# EAGLE design silelis_version1 (EAGLE 7.6.0)
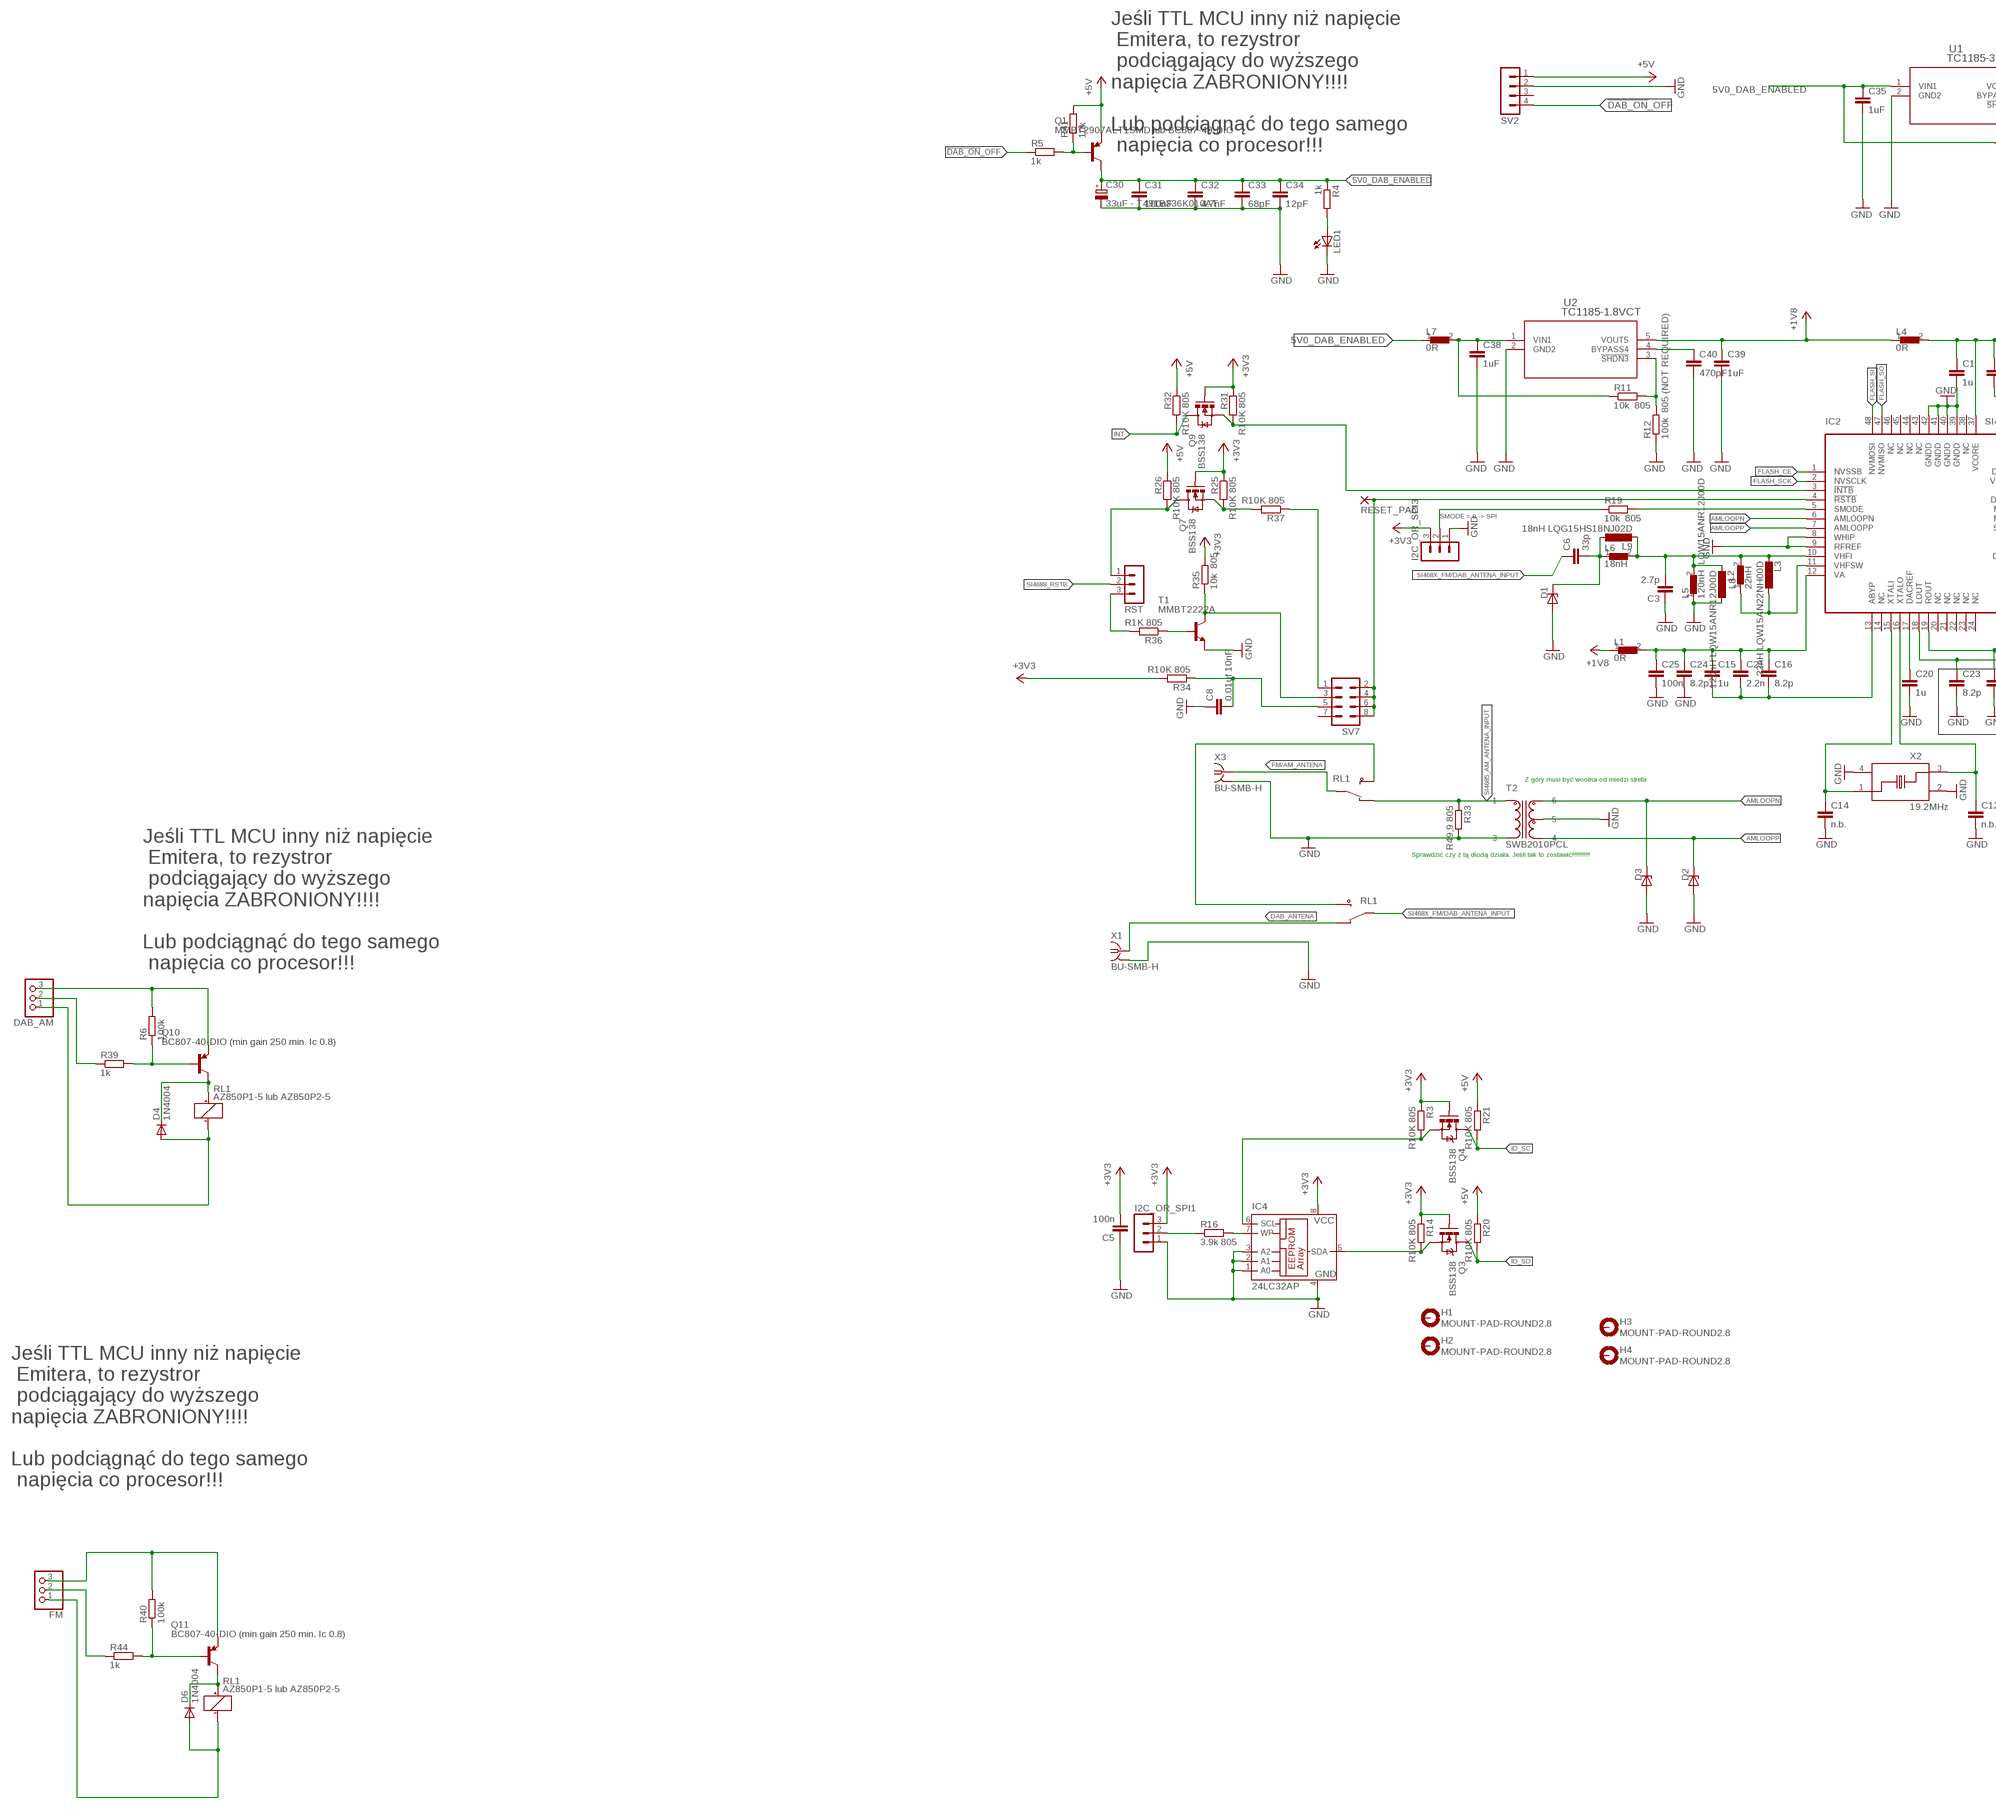
[diagram p0: schematic, sheet 1, part 1 of 2]
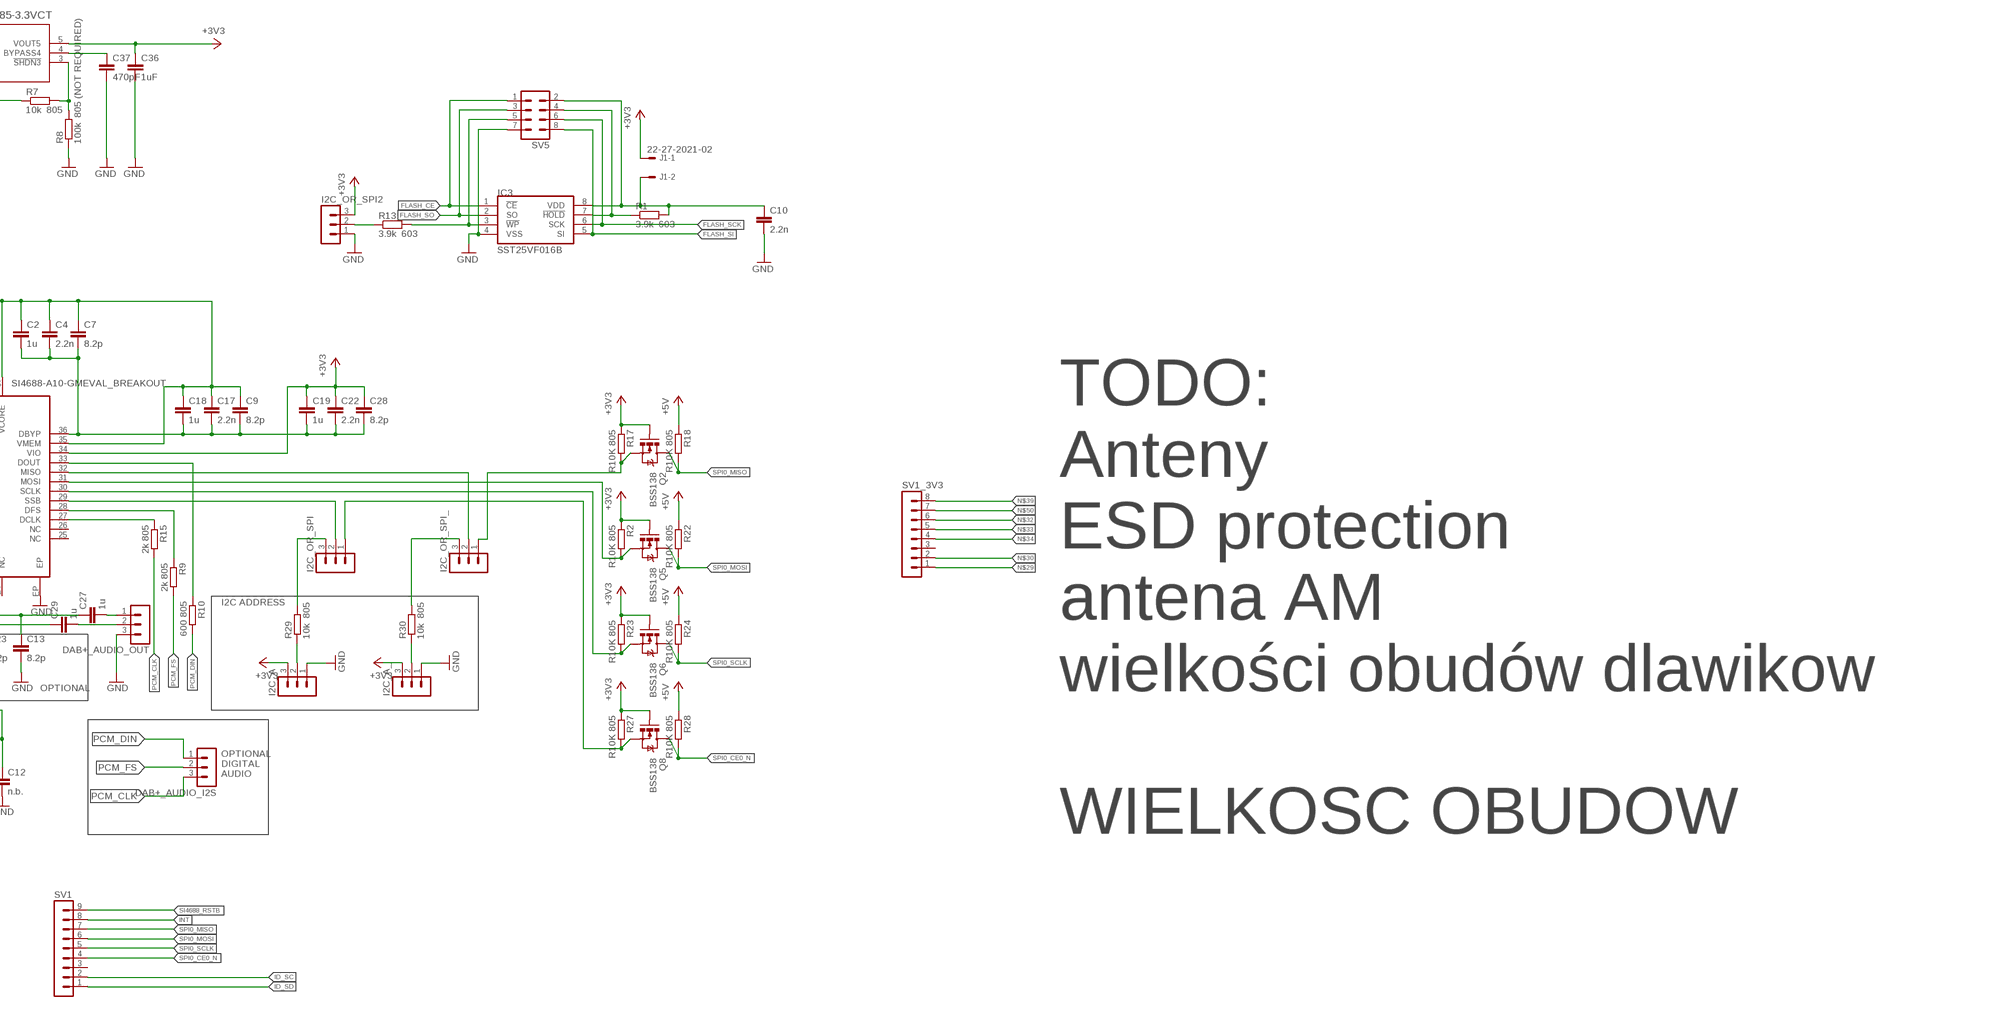
[diagram p1: schematic, sheet 1, part 2 of 2]

## Parts
C1  1u  C-EUC0805  [C0805]
C2  1u  C-EUC0805  [C0805]
C3  2.7p  C-EUC0603  [C0603]
C4  2.2n  C-EUC0805  [C0805]
C5  100n  C-EUC0805  [C0805]
C6  33p  C-EUC0603  [C0603]
C7  8.2p  C-EUC0805  [C0805]
C8  0.01uf 10nF  C-EUC0805  [C0805]
C9  8.2p  C-EUC0805  [C0805]
C10  2.2n  C-EUC0805  [C0805]
C12  n.b.  C-EUC0805  [C0805]
C13  8.2p  C-EUC0805  [C0805]
C14  n.b.  C-EUC0805  [C0805]
C15  1u  C-EUC0805  [C0805]
C16  8.2p  C-EUC0805  [C0805]
C17  2.2n  C-EUC0805  [C0805]
C18  1u  C-EUC0805  [C0805]
C19  1u  C-EUC0805  [C0805]
C20  1u  C-EUC0805  [C0805]
C21  2.2n  C-EUC0805  [C0805]
C22  2.2n  C-EUC0805  [C0805]
C23  8.2p  C-EUC0805  [C0805]
C24  8.2p  C-EUC0805  [C0805]
C25  100n  C-EUC0805  [C0805]
C27  1u  C-EUC0805  [C0805]
C28  8.2p  C-EUC0805  [C0805]
C29  1u  C-EUC0805  [C0805]
C30  33uF - T491B336K010AT  CPOL-EUSMCB  [SMC_B]
C31  100nF  C-EUC0805  [C0805]
C32  4.7nF  C-EUC0805  [C0805]
C33  68pF  C-EUC0805  [C0805]
C34  12pF  C-EUC0603K  [C0603K]
C35  1uF  C-EUC0805  [C0805]
C36  1uF  C-EUC0805  [C0805]
C37  470pF  C-EUC0805  [C0805]
C38  1uF  C-EUC0805  [C0805]
C39  1uF  C-EUC0805  [C0805]
C40  470pF  C-EUC0805  [C0805]
D1  ESD9L5.0  [SOD923]
D2  ESD9L5.0  [SOD923]
D3  ESD9L5.0  [SOD923]
D4  1N4004  [DO41-10]
D6  1N4004  [DO41-10]
DAB+_AUDIO_I2S  MA03-1  [MA03-1]
DAB+_AUDIO_OUT  MA03-1  [MA03-1]
DAB_AM  PINHD-1X03_2.54-SMD  [1X03SMD]
FM  PINHD-1X03_2.54-SMD  [1X03SMD]
H1  MOUNT-PAD-ROUND2.8  [2,8-PAD]
H2  MOUNT-PAD-ROUND2.8  [2,8-PAD]
H3  MOUNT-PAD-ROUND2.8  [2,8-PAD]
H4  MOUNT-PAD-ROUND2.8  [2,8-PAD]
I2C_A  MA03-1  [MA03-1]
I2C_A_  MA03-1  [MA03-1]
I2C_OR_SPI  MA03-1  [MA03-1]
I2C_OR_SPI1  MA03-1  [MA03-1]
I2C_OR_SPI2  MA03-1  [MA03-1]
I2C_OR_SPI3  MA03-1  [MA03-1]
I2C_OR_SPI_  MA03-1  [MA03-1]
IC2  SI4688-A10-GMEVAL_BREAKOUT  [QFN48-BREAKOUT]
IC3  SST25VF016B  [SOIC-8]
IC4  24LC32AP  [DIL8]
J1  22-27-2021-02  [6410-02]
L1  0R  FERRITR0805  [R0805]
L2  120nH LQW15ANR12J00D  L0402  [SMD0402]
L3  22nH LQW15AN22NH00D  L0402  [SMD0402]
L4  0R  FERRITR0805  [R0805]
L5  120nH LQW15ANR12J00D  FERRITR0805  [R0805]
L6  18nH  FERRITR0805  [R0805]
L7  0R  FERRITR0805  [R0805]
L8  22nH  FERRITR0805  [R0805]
L9  18nH LQG15HS18NJ02D  L0402  [SMD0402]
LED1  LED3MM  [LED3MM]
Q1  MMBT2907ALT1SMD lub BC807-40-DIO  MMBT2907ALT1SMD  [SOT23-BEC]
Q2  BSS138  MOSFET-NCHANNELSMD  [SOT23-3]
Q3  BSS138  MOSFET-NCHANNELSMD  [SOT23-3]
Q4  BSS138  MOSFET-NCHANNELSMD  [SOT23-3]
Q5  BSS138  MOSFET-NCHANNELSMD  [SOT23-3]
Q6  BSS138  MOSFET-NCHANNELSMD  [SOT23-3]
Q7  BSS138  MOSFET-NCHANNELSMD  [SOT23-3]
Q8  BSS138  MOSFET-NCHANNELSMD  [SOT23-3]
Q9  BSS138  MOSFET-NCHANNELSMD  [SOT23-3]
Q10  BC807-40-DIO (min gain 250 min. Ic 0.8)  MMBT2907ALT1SMD  [SOT23-BEC]
Q11  BC807-40-DIO (min gain 250 min. Ic 0.8)  MMBT2907ALT1SMD  [SOT23-BEC]
R1  3.9k 603  R-EU_R0603  [R0603]
R2  R10K 805  R-EU_R0805  [R0805]
R3  R10K 805  R-EU_R0805  [R0805]
R4  1k  R-EU_M0805  [M0805]
R5  1k  R-EU_M0805  [M0805]
R6  100k  R-EU_M0805  [M0805]
R7  10k 805  R-EU_M0805  [M0805]
R8  100k 805 (NOT REQUIRED)  R-EU_M0805  [M0805]
R9  2k 805  R-EU_M0805  [M0805]
R10  600 805  R-EU_M0805  [M0805]
R11  10k 805  R-EU_M0805  [M0805]
R12  100k 805 (NOT REQUIRED)  R-EU_M0805  [M0805]
R13  3.9k 603  R-EU_R0603  [R0603]
R14  R10K 805  R-EU_R0805  [R0805]
R15  2k 805  R-EU_M0805  [M0805]
R16  3.9k 805  R-EU_R0805  [R0805]
R17  R10K 805  R-EU_R0805  [R0805]
R18  R10K 805  R-EU_R0805  [R0805]
R19  10k 805  R-EU_M0805  [M0805]
R20  R10K 805  R-EU_R0805  [R0805]
R21  R10K 805  R-EU_R0805  [R0805]
R22  R10K 805  R-EU_R0805  [R0805]
R23  R10K 805  R-EU_R0805  [R0805]
R24  R10K 805  R-EU_R0805  [R0805]
R25  R10K 805  R-EU_R0805  [R0805]
R26  R10K 805  R-EU_R0805  [R0805]
R27  R10K 805  R-EU_R0805  [R0805]
R28  R10K 805  R-EU_R0805  [R0805]
R29  10k 805  R-EU_M0805  [M0805]
R30  10k 805  R-EU_M0805  [M0805]
R31  R10K 805  R-EU_R0805  [R0805]
R32  R10K 805  R-EU_R0805  [R0805]
R33  R49,9 805  R-EU_R0805  [R0805]
R34  R10K 805  R-EU_R0805  [R0805]
R35  10k 805  R-EU_M0805  [M0805]
R36  R1K 805  R-EU_R0805  [R0805]
R37  R10K 805  R-EU_R0805  [R0805]
R39  1k  R-EU_M0805  [M0805]
R40  100k  R-EU_M0805  [M0805]
R41  10k  R-EU_M0805  [M0805]
R44  1k  R-EU_M0805  [M0805]
RESET_PAD  SMD2  [SMD1,27-2,54]
RL1  AZ850P1-5 lub AZ850P2-5  AZ850P2-12  [AZ850-2C]
RST  MA03-1  [MA03-1]
SV1  MA09-1  [MA09-1]
SV1_3V3  MA08-1  [MA08-1]
SV2  MA04-1  [MA04-1]
SV5  MA04-2  [MA04-2]
SV7  MA04-2  [MA04-2]
T1  MMBT2222A  MMBT918LT1-NPN-SOT23-BEC  [SOT23-BEC]
T2  SWB2010PCL  [COILCRAFT-SWBXXXX-PCL]
U1  TC1185-3.3VCT  TC1185-X.XXCT713SOT-23-5_MC-M  [SOT-23-5_MC-M]
U2  TC1185-1.8VCT  TC1185-X.XXCT713SOT-23-5_MC-M  [SOT-23-5_MC-M]
X1  BU-SMB-H  [BU-SMB-H]
X2  19.2MHz  XTAL_3.2X2.5  [XTAL_3.2X2.5]
X3  BU-SMB-H  [BU-SMB-H]

## Nets
5V0_DAB_ENABLED: C30.+ C31.1 C32.1 C33.1 C34.1 C35.1 L7.1 Q1.C R4.1 R7.1 U1.1(VIN1)
!DAB_ON!_OFF: R5.1 SV2.4
+1V8: C39.1 L1.1 L4.1 U2.5(VOUT5)
+3V3: C5.2 C19.1 C22.1 C28.1 C36.1 I2C_A.3 I2C_A_.3 I2C_OR_SPI1.3 I2C_OR_SPI2.3 I2C_OR_SPI3.3 IC2.34(VIO) IC4.8(VCC) J1.1 Q2.1(G) Q3.1(G) Q4.1(G) Q5.1(G) Q6.1(G) Q7.1(G) Q8.1(G) Q9.1(G) R2.1 R3.1 R14.1 R17.1 R23.1 R25.1 R27.1 R31.1 R34.2 R35.2 U1.5(VOUT5)
+5V: Q1.E R18.1 R20.1 R21.1 R22.1 R24.1 R26.1 R28.1 R32.1 R41.2 SV2.1
AMLOOPN: D3.K(C) IC2.6(AMLOOPN) T2.P$6
AMLOOPP: D2.K(C) IC2.7(AMLOOPP) T2.P$4
DAB/AM_POSITION: DAB_AM.2 R39.1
DAB_ANTENA: RL1.P$9 X1.1
FLASH_CE: IC2.1(NVSSB) IC3.1(!CE) SV5.1
FLASH_SCK: IC2.2(NVSCLK) IC3.6(SCK) SV5.6
FLASH_SI: IC2.48(NVMOSI) IC3.5(SI) SV5.8
FLASH_SO: IC2.47(NVMISO) IC3.2(SO) SV5.3
FM/AM_ANTENA: RL1.P$3 X3.1
FM/AM_ANTENA_TO_SI468X_FM/DAB_ANTENA_INPUT: RL1.P$4 RL1.P$7
FM_POSITION: FM.2 R44.1
GND: C1.2 C3.1 C5.1 C8.1 C10.2 C12.2 C13.2 C14.2 C20.2 C23.2 C24.2 C25.2 C30.- C31.2 C32.2 C33.2 C34.2 C35.2 C36.2 C37.2 C38.2 C39.2 C40.2 D1.A D2.A D3.A DAB+_AUDIO_OUT.3 I2C_A.1 I2C_A_.1 I2C_OR_SPI1.1 I2C_OR_SPI2.1 I2C_OR_SPI3.1 IC2.8(WHIP) IC2.9(RFREF) IC2.39(GNDD) IC2.40(GNDD) IC2.41(GNDD) IC2.42(GNDD) IC2.EP IC3.4(VSS) IC4.1(A0) IC4.2(A1) IC4.3(A2) IC4.4(GND) L2.1 L5.1 LED1.K(C) R8.1 R12.1 R33.2 SV2.2 SV5.7 T1.E T2.P$3 T2.P$5 U1.2(GND2) U2.2(GND2) X1.2 X1.3 X1.4 X1.5 X2.2(GND) X2.4(GND) X3.2 X3.3 X3.4 X3.5
ID_SC: Q4.3(D) R21.2 SV1.2
ID_SD: Q3.3(D) R20.2 SV1.1
INT: Q9.3(D) R32.2 SV1.8
N$1: C6.2 D1.K(C) L6.1 L9.1
N$2: C3.2 IC2.10(VHFI) L2.2 L3.2 L5.2 L6.2 L8.2 L9.2
N$3: IC2.11(VHFSW) L3.1 L8.1
N$4: C15.2 C16.2 C21.2 IC2.13(ABYP)
N$5: C2.2 C4.2 C7.2 C9.2 C17.2 C18.2 C19.2 C22.2 C28.2 IC2.36(DBYP)
N$6: C14.1 IC2.15(XTALI) X2.1
N$7: C12.1 IC2.16(XTALO) X2.3
N$8: C20.1 IC2.17(DACREF)
N$9: IC2.4(!RSTB!) RESET_PAD.1(P) SV7.2 SV7.4 SV7.6 SV7.8
N$10: I2C_OR_SPI2.2 R13.1
N$11: C38.1 L7.2 R11.1 U2.1(VIN1)
N$12: C15.1 C16.1 C21.1 C24.1 C25.1 IC2.12(VA) L1.2
N$13: D4.A DAB_AM.1 RL1.P$5(COIL$1:-)
N$14: C1.1 C2.1 C4.1 C7.1 C9.1 C17.1 C18.1 IC2.35(VMEM) IC2.37(VCORE) L4.2
N$15: IC2.28(DFS) R9.1
N$16: IC2.33(DOUT) R10.1
N$17: IC4.7(WP) R16.2
N$18: LED1.A R4.2
N$19: Q1.B R5.2 R41.1
N$20: C37.1 U1.4(BYPASS4)
N$21: R7.2 R8.2 U1.3(!SHDN3)
N$22: IC3.7(!HOLD) R1.1 SV5.4
N$23: IC2.27(DCLK) R15.1
N$24: C40.1 U2.4(BYPASS4)
N$25: R11.2 R12.2 U2.3(!SHDN3)
N$26: I2C_OR_SPI3.2 R19.1
N$27: IC2.5(SMODE) R19.2
N$28: I2C_OR_SPI1.2 R16.1
N$29: IC4.5(SDA) Q3.2(S) R14.2 SV1_3V3.1
N$30: IC4.6(SCL) Q4.2(S) R3.2 SV1_3V3.2
N$31: I2C_OR_SPI_.2 IC2.32(MISO)
N$32: IC2.31(MOSI) Q5.2(S) R2.2 SV1_3V3.6
N$33: IC2.30(SCLK) Q6.2(S) R23.2 SV1_3V3.5
N$34: I2C_OR_SPI.1 Q8.2(S) R27.2 SV1_3V3.4
N$35: I2C_A.2 R29.1
N$36: I2C_A_.2 R30.1
N$37: I2C_OR_SPI.3 R29.2
N$38: I2C_OR_SPI_.3 R30.2
N$39: IC2.3(!INTB!) Q9.2(S) R31.2 SV1_3V3.8
N$41: R35.1 SV7.3 T1.C
N$44: C10.1 IC3.8(VDD) J1.2 R1.2 SV5.2
N$45: IC3.3(!WP) R13.2 SV5.5
N$46: C27.2 DAB+_AUDIO_OUT.1
N$47: C29.2 DAB+_AUDIO_OUT.2
N$48: I2C_OR_SPI.2 IC2.29(SSB)
N$50: I2C_OR_SPI_.1 Q2.2(S) R17.2 SV1_3V3.7
N$51: R36.2 RST.3
N$52: C8.2 R34.1 SV7.5
N$54: R36.1 T1.B
N$55: Q7.2(S) R25.2 R37.2
N$56: Q7.3(D) R26.2 RST.1
N$57: R37.1 SV7.1
N$58: Q10.B R6.1 R39.2
N$59: DAB_AM.3 Q10.E R6.2
N$60: D4.C Q10.C RL1.P$1(COIL$1:+)
N$63: Q11.B R40.1 R44.2
N$64: FM.3 Q11.E R40.2
N$66: D6.A FM.1 RL1.P$6(COIL$2:-)
N$68: D6.C Q11.C RL1.P$10(COIL$2:+)
PCM_CLK: DAB+_AUDIO_I2S.3 R15.2
PCM_DIN: DAB+_AUDIO_I2S.1 R10.2
PCM_FS: DAB+_AUDIO_I2S.2 R9.2
SI468X_FM/DAB_ANTENA_INPUT: C6.1 RL1.P$8
SI4685_AM_ANTENA_INPUT: R33.1 RL1.P$2 T2.P$1
SI4688_LOUT: C23.1 C29.1 IC2.18(LOUT)
SI4688_ROUT: C13.1 C27.1 IC2.19(ROUT)
SI4688_RSTB: RST.2 SV1.9
SPI0_CE0_N: Q8.3(D) R28.2 SV1.4
SPI0_MISO: Q2.3(D) R18.2 SV1.7
SPI0_MOSI: Q5.3(D) R22.2 SV1.6
SPI0_SCLK: Q6.3(D) R24.2 SV1.5
Unconnected: H1.B2,8(MOUNT) H2.B2,8(MOUNT) H3.B2,8(MOUNT) H4.B2,8(MOUNT) IC2.14(NC) IC2.20(NC) IC2.21(NC) IC2.22(NC) IC2.23(NC) IC2.24(NC) IC2.25(NC) IC2.26(NC) IC2.38(NC) IC2.43(NC) IC2.44(NC) IC2.45(NC) IC2.46(NC) SV1.3 SV1_3V3.3 SV2.3 SV7.7

## Notes on the sheet
- Jeśli TTL MCU inny niż napięcie
   Emitera, to rezystror
   podciągający do wyższego 
  napięcia ZABRONIONY!!!!
  
  Lub podciągnąć do tego samego
   napięcia co procesor!!!
- SMODE = 0 -> SPI
- I2C ADDRESS
- OPTIONAL
- Z góry musi być woolna od miedzi strefa
- OPTIONAL
  DIGITAL
  AUDIO
- Sprawdzić czy z tą diodą działa. Jeśli tak to zostawić!!!!!!!!!!!!
- TODO:
  Anteny
  ESD protection
  antena AM
  wielkości obudów dlawikow
  
  WIELKOSC OBUDOW
- Jeśli TTL MCU inny niż napięcie
   Emitera, to rezystror
   podciągający do wyższego 
  napięcia ZABRONIONY!!!!
  
  Lub podciągnąć do tego samego
   napięcia co procesor!!!
- Jeśli TTL MCU inny niż napięcie
   Emitera, to rezystror
   podciągający do wyższego 
  napięcia ZABRONIONY!!!!
  
  Lub podciągnąć do tego samego
   napięcia co procesor!!!

## Library data of the parts
C1-C7 C9 C10 C12-C25 C27-C29 C31-C40 = resistor:C-EU: CAPACITOR, European symbol
C8 = rcl:C-EU: CAPACITOR, European symbol
C30 = resistor:CPOL-EU: POLARIZED CAPACITOR, European symbol; PARTNUM: TAJB336K010R; SUPPLIER: TME
D1-D3 = generisch:ESD9L5.0
D4 D6 = adafruit:1N4004: DIODE General purpose 1N400x type rectifier (With bigger pads) http://www.ladyada.net/library/pcb/eaglelibrary.html
DAB+_AUDIO_I2S DAB+_AUDIO_OUT I2C_A I2C_A_ I2C_OR_SPI I2C_OR_SPI1-I2C_OR_SPI3 I2C_OR_SPI_ RST = con-lstb:MA03-1: PIN HEADER; OC_FARNELL: unknown; OC_NEWARK: unknown
DAB_AM FM = pinhead-2:PINHD-1X03: PIN HEADER
H1-H4 = holes:MOUNT-PAD-ROUND: MOUNTING PAD, round
IC2 = SI4688-A10-GM:SI4688-A10-GM
IC3 = sst25:SST25VF016B
IC4 = microchip:24*: Serial EEPROM I2C; MF: MICROCHIP; MPN: 24LC32A/P; OC_FARNELL: 1084246; OC_NEWARK: 75K1884
J1 = con-molex:22-?-02: CONNECTOR wire to board 2.54 mm (.1 inch) pitch header; OC_FARNELL: unknown; OC_NEWARK: unknown
L1 L4-L8 = ferrit_bear:FERRIT
L2 L3 L9 = generisch:L0402
LED1 = led:LED: LED OSRAM: - CHIPLED LG R971, LG N971, LY N971, LG Q971, LY Q971, LO R971, LY R971 LH N974, LH R974 LS Q976, LO Q976, LY Q976 LO Q996 - Hyper CHIPLED LW Q18S LB Q993, LB Q99A, LB R99A - SideLED LS A670, LO A670, LY A670, LG A670, LP A670 LB A673, LV A673, LT A673, LW A673 LH A674 LY A675 LS A676, LA A676, LO A676, LY A676, LW A676 LS A679, LY A679, LG A679 - Hyper Micro SIDELED® LS Y876, LA Y876, LO Y876, LY Y876 LT Y87S - SmartLED LW L88C, LW L88S LB L89C, LB L89S, LG L890 LS L89K, LO L89K, LY L89K LS L896, LA L896, LO L896, LY L896 - TOPLED LS T670, LO T670, LY T670, LG T670, LP T670 LSG T670, LSP T670, LSY T670, LOP T670, LYG T670 LG T671, LOG T671, LSG T671 LB T673, LV T673, LT T673, LW T673 LH T674 LS T676, LA T676, LO T676, LY T676, LB T676, LH T676, LSB T676, LW T676 LB T67C, LV T67C, LT T67C, LS T67K, LO T67K, LY T67K, LW E67C LS E67B, LA E67B, LO E67B, LY E67B, LB E67C, LV E67C, LT E67C LW T67C LS T679, LY T679, LG T679 LS T770, LO T770, LY T770, LG T770, LP T770 LB T773, LV T773, LT T773, LW T773 LH T774 LS E675, LA E675, LY E675, LS T675 LS T776, LA T776, LO T776, LY T776, LB T776 LHGB T686 LT T68C, LB T68C - Hyper Mini TOPLED® LB M676 - Mini TOPLED Santana® LG M470 LS M47K, LO M47K, LY M47K Source: http://www.osram.convergy.de LUXEON: - LUMILED® LXK2-PW12-R00, LXK2-PW12-S00, LXK2-PW14-U00, LXK2-PW14-V00 LXK2-PM12-R00, LXK2-PM12-S00, LXK2-PM14-U00 LXK2-PE12-Q00, LXK2-PE12-R00, LXK2-PE12-S00, LXK2-PE14-T00, LXK2-PE14-U00 LXK2-PB12-K00, LXK2-PB12-L00, LXK2-PB12-M00, LXK2-PB14-N00, LXK2-PB14-P00, LXK2-PB14-Q00 LXK2-PR12-L00, LXK2-PR12-M00, LXK2-PR14-Q00, LXK2-PR14-R00 LXK2-PD12-Q00, LXK2-PD12-R00, LXK2-PD12-S00 LXK2-PH12-R00, LXK2-PH12-S00 LXK2-PL12-P00, LXK2-PL12-Q00, LXK2-PL12-R00 Source: www.luxeon.com KINGBRIGHT: KA-3528ASYC Source: www.kingbright.com
Q1 Q10 Q11 = transistor-pnp:MMBT2907*: PNP Transistror
Q2-Q9 = SparkFun:MOSFET-NCHANNEL
R1-R32 R35 R39-R41 R44 = rcl:R-EU_: RESISTOR, European symbol
R33 R34 R36 R37 = resistor:R-EU_: RESISTOR, European symbol
RESET_PAD = wirepad:SMD2: SMD PAD
RL1 = relay_silelis:AZ850P2-12
SV1 = con-lstb:MA09-1: PIN HEADER; OC_FARNELL: unknown; OC_NEWARK: unknown
SV1_3V3 = con-lstb:MA08-1: PIN HEADER; OC_FARNELL: unknown; OC_NEWARK: unknown
SV2 = con-lstb:MA04-1: PIN HEADER; OC_FARNELL: unknown; OC_NEWARK: unknown
SV5 SV7 = con-lstb:MA04-2: PIN HEADER; OC_FARNELL: unknown; OC_NEWARK: unknown
T1 = transistor:*-NPN-: NPN Transistror BF959 corrected 2008.03.06
T2 = CoilCraft:SWB2010
U1 U2 = TC1185:TC1185-X.XXCT713; MANUFACTURER_PART_NUMBER: TC1185X.XXCT713; VENDOR: Microchip
X1 X3 = con-coax:BU-SMB-H: FEMALE SMB CONNECTOR Radiall distributor RS 112-3003; OC_FARNELL: unknown; OC_NEWARK: unknown
X2 = generisch:XTAL_3.2X2.5

## Board
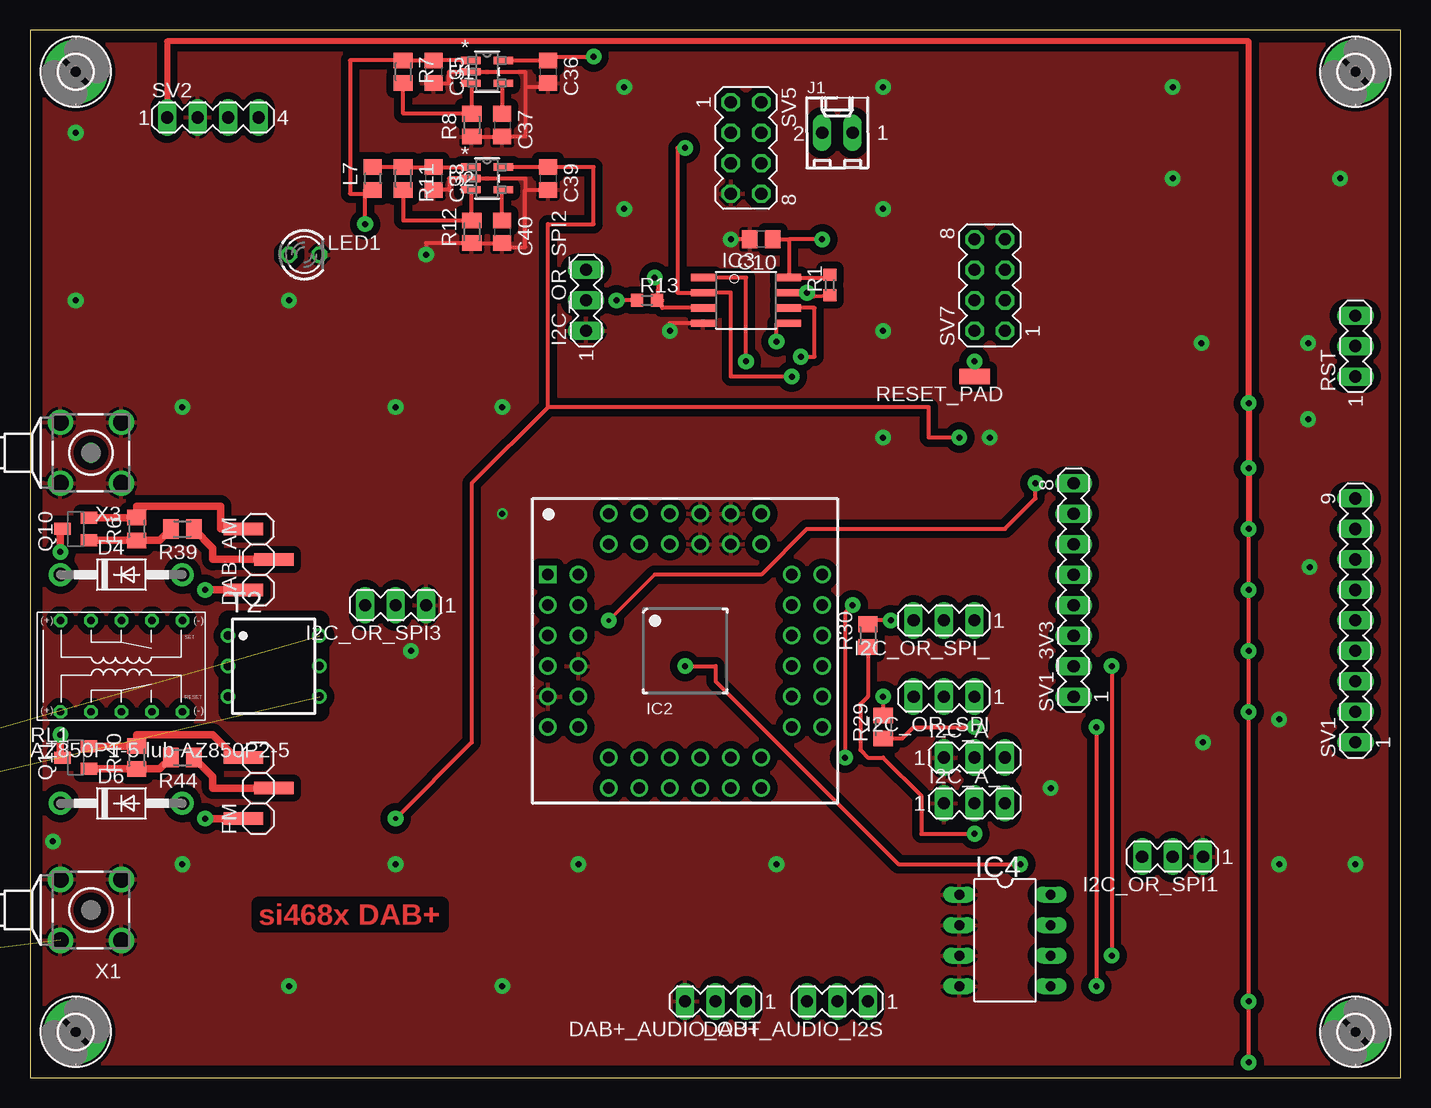
[diagram p2: board, top side]
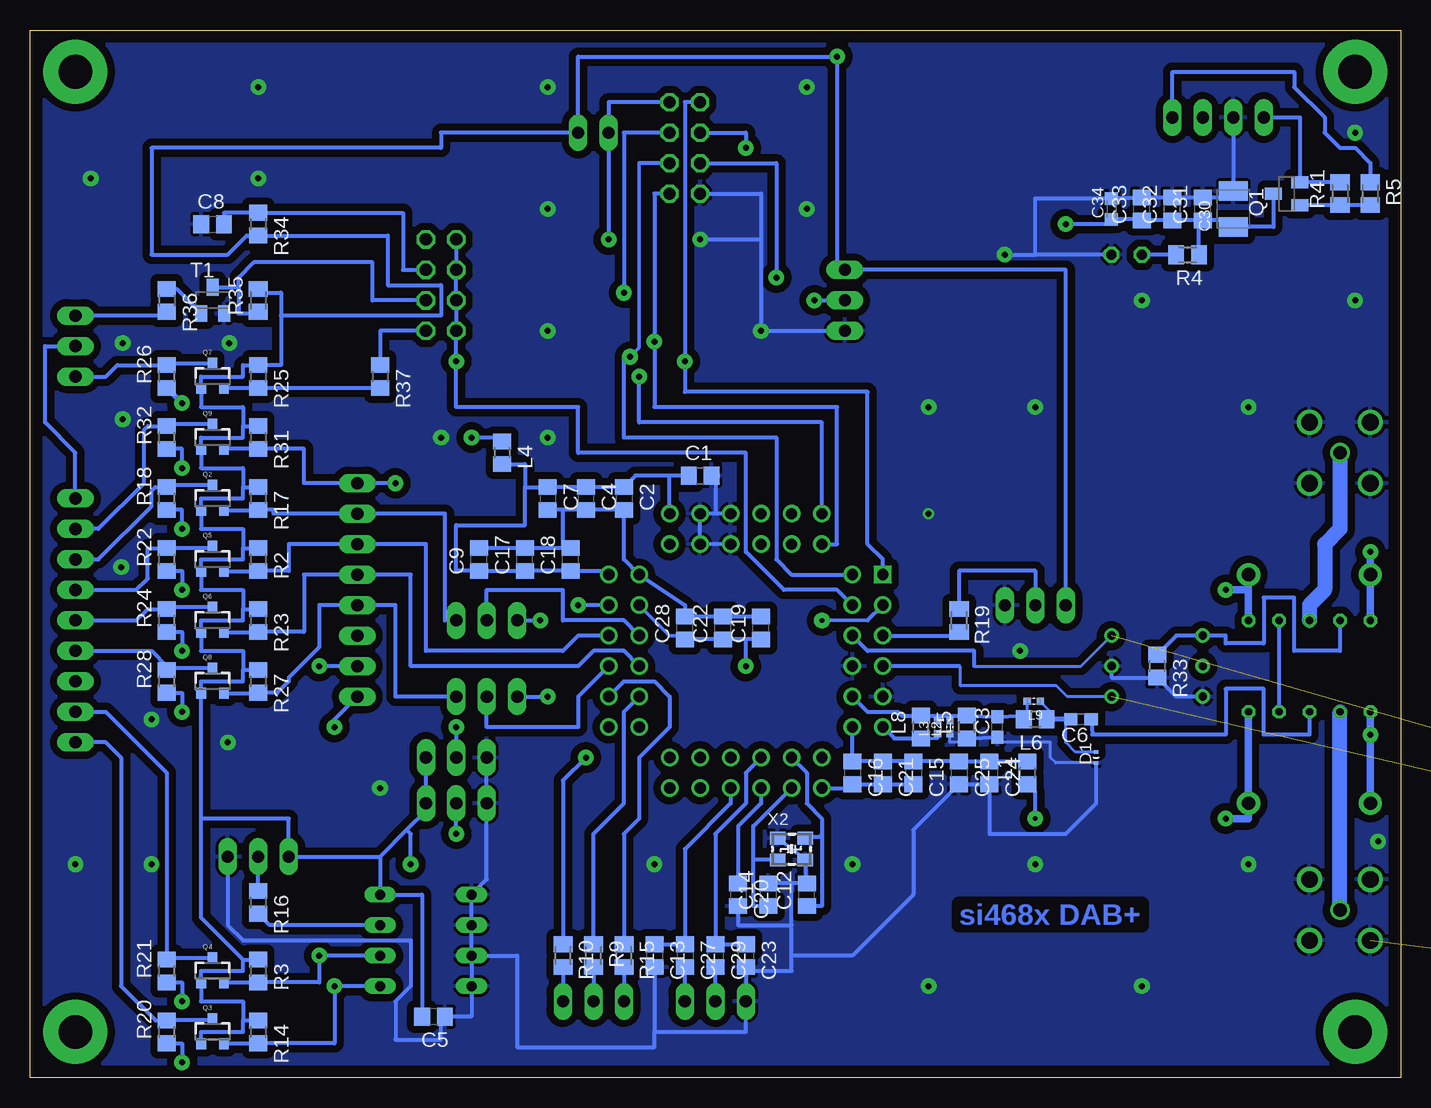
[diagram p3: board, bottom side, seen from below]

Size 114.28 x 87.3 mm. Coordinates in mm from the lower left corner, seen from the top.
Outline: 0,0 114.28,0 114.28,87.3 0,87.3 0,0
Copper layers (1*16): Top 0.035mm / dielectric 1.5mm / Bottom 0.035mm
Design rules "default": minimum track width 10mil, minimum drill 24mil, track to track 8mil, track to pad 8mil, pad to pad 8mil, via to via 8mil, smd to smd 8mil, copper to edge 40mil, drill to drill 8mil, minimum pad ring 10mil, minimum via ring 8mil, stop-mask expansion 4mil, vias tented up to drill 0mil, thermal gap 10mil

### Footprints (pad centres in the part's own frame; a part is rotated, then mirrored left to right if it is on the bottom)
C0805 = smd 1.3 x 1.5: 1 -0.95,0; 2 0.95,0
C0603 = smd 1.1 x 1: 1 -0.85,0; 2 0.85,0
SMC_B = smd 1.6 x 2.4: + -1.5,0; - 1.5,0
C0603K = smd 1.05 x 1.08: 1 -0.875,0; 2 0.875,0
SOD923 = smd 0.3 x 0.4: A -0.45,0; K 0.45,0
DO41-10 = drill 1.118 pad 1.93: A 5.08,0; C -5.08,0
MA03-1 = drill 1.016 long: 1 -2.54,0; 2 0,0; 3 2.54,0
1X03SMD = smd 1.016 x 3.302: 1 -1.27,1.27; 2 1.27,-1.27; 3 3.81,1.27
2,8-PAD = drill 2.8 pad 5.334: B2,8 0,0
QFN48-BREAKOUT = drill 0.95 square: 1 -11.43,6.35 | drill 0.95: 2 -8.89,6.35; 3 -11.43,3.81; 4 -8.89,3.81; 5 -11.43,1.27; 6 -8.89,1.27; 7 -11.43,-1.27; 8 -8.89,-1.27; 9 -11.43,-3.81; 10 -8.89,-3.81; 11 -11.43,-6.35; 12 -8.89,-6.35; 13 -6.35,-11.43; 14 -6.35,-8.89; 15 -3.81,-11.43; 16 -3.81,-8.89; 17 -1.27,-11.43; 18 -1.27,-8.89; 19 1.27,-11.43; 20 1.27,-8.89; 21 3.81,-11.43; 22 3.81,-8.89; 23 6.35,-11.43; 24 6.35,-8.89; 25 11.43,-6.35; 26 8.89,-6.35; 27 11.43,-3.81; 28 8.89,-3.81; 29 11.43,-1.27; 30 8.89,-1.27; 31 11.43,1.27; 32 8.89,1.27; 33 11.43,3.81; 34 8.89,3.81; 35 11.43,6.35; 36 8.89,6.35; 37 6.35,11.43; 38 6.35,8.89; 39 3.81,11.43; 40 3.81,8.89; 41 1.27,11.43; 42 1.27,8.89; 43 -1.27,11.43; 44 -1.27,8.89; 45 -3.81,11.43; 46 -3.81,8.89; 47 -6.35,11.43; 48 -6.35,8.89 | smd 0.635 x 0.635 bottom: EP 3.81,11.43
SOIC-8 = smd 0.61 x 2: 1 -1.905,-3.6; 2 -0.635,-3.6; 3 0.635,-3.6; 4 1.905,-3.6; 5 1.905,3.6; 6 0.635,3.6; 7 -0.635,3.6; 8 -1.905,3.6
DIL8 = drill 0.813 long: 1 -3.81,-3.81; 2 -1.27,-3.81; 3 1.27,-3.81; 4 3.81,-3.81; 5 3.81,3.81; 6 1.27,3.81; 7 -1.27,3.81; 8 -3.81,3.81
6410-02 = drill 1.016 long: 1 1.27,0; 2 -1.27,0
R0805 = smd 1.3 x 1.5: 1 -0.95,0; 2 0.95,0
SMD0402 = smd 0.6 x 0.6: 1 -0.55,0; 2 0.55,0
LED3MM = drill 0.813 octagon: A -1.27,0; K 1.27,0
SOT23-BEC = smd 1 x 1.4: B -0.95,-1.1; C 0,1.1; E 0.95,-1.1
SOT23-3 = smd 0.8 x 0.9: 1 -0.95,-1; 2 0.95,-1; 3 0,1.1
R0603 = smd 1 x 1.1: 1 -0.85,0; 2 0.85,0
M0805 = smd 1.3 x 1.6: 1 -0.95,0; 2 0.95,0
SMD1,27-2,54 = smd 1.27 x 2.54: 1 0,0
AZ850-2C = drill 0.6 octagon: P$1 -5.08,3.81; P$2 -2.54,3.81; P$3 0,3.81; P$4 2.54,3.81; P$5 5.08,3.81; P$6 5.08,-3.81; P$7 2.54,-3.81; P$8 0,-3.81; P$9 -2.54,-3.81; P$10 -5.08,-3.81
MA09-1 = drill 1.016 long: 1 -10.16,0; 2 -7.62,0; 3 -5.08,0; 4 -2.54,0; 5 0,0; 6 2.54,0; 7 5.08,0; 8 7.62,0; 9 10.16,0
MA08-1 = drill 1.016 long: 1 -8.89,0; 2 -6.35,0; 3 -3.81,0; 4 -1.27,0; 5 1.27,0; 6 3.81,0; 7 6.35,0; 8 8.89,0
MA04-1 = drill 1.016 long: 1 -3.81,0; 2 -1.27,0; 3 1.27,0; 4 3.81,0
MA04-2 = drill 1.016 octagon: 1 -3.81,-1.27; 2 -3.81,1.27; 3 -1.27,-1.27; 4 -1.27,1.27; 5 1.27,-1.27; 6 1.27,1.27; 7 3.81,-1.27; 8 3.81,1.27
COILCRAFT-SWBXXXX-PCL = drill 0.7: P$1 -3.81,2.54; P$2 -3.81,0; P$3 -3.81,-2.54; P$4 3.81,-2.54; P$5 3.81,0; P$6 3.81,2.54
SOT-23-5_MC-M = smd 1.626 x 0.61: 1 -1.346,0.95; 2 -1.346,0; 3 -1.346,-0.95; 4 1.346,-0.95; 5 1.346,0.95
BU-SMB-H = drill 1.1: 1 0,0 | drill 1.4: 2 -2.54,2.54; 3 2.54,2.54; 4 2.54,-2.54; 5 -2.54,-2.54
XTAL_3.2X2.5 = smd 1.3 x 1.05: 1 -1.15,-0.9; 2 1.15,-0.9; 3 1.15,0.9; 4 -1.15,0.9

### Placement (x,y rotation side)
C1  58.42,50.17 0 bottom
C2  64.77,48.26 270 bottom
C3  33.66,29.21 90 bottom
C4  67.94,48.26 270 bottom
C5  80.65,5.08 180 bottom
C6  26.67,29.85 180 bottom
C7  71.12,48.26 270 bottom
C8  99.06,71.12 0 bottom
C9  76.84,43.18 90 bottom
C10  60.96,69.85 180 top
C12  49.53,15.24 90 bottom
C13  62.23,10.16 270 bottom
C14  52.71,15.24 90 bottom
C15  40.64,25.4 270 bottom
C16  45.72,25.4 270 bottom
C17  73.03,43.18 90 bottom
C18  69.22,43.18 90 bottom
C19  53.34,37.47 90 bottom
C20  55.25,15.24 270 bottom
C21  43.18,25.4 270 bottom
C22  56.52,37.47 90 bottom
C23  54.61,10.16 270 bottom
C24  34.29,25.4 270 bottom
C25  36.83,25.4 270 bottom
C27  59.69,10.16 270 bottom
C28  59.69,37.47 90 bottom
C29  57.15,10.16 270 bottom
C30  13.97,72.39 90 bottom
C31  16.51,72.39 90 bottom
C32  19.05,72.39 90 bottom
C33  21.59,72.39 90 bottom
C34  24.13,72.39 90 bottom
C35  33.66,83.82 270 top
C36  43.18,83.82 270 top
C37  39.37,79.38 270 top
C38  33.66,74.93 270 top
C39  43.18,74.93 270 top
C40  39.37,70.48 270 top
D1  25.4,26.67 90 bottom
D2  -139.7,-6.35 0 top  (outside the outline)
D3  -139.7,-10.16 0 top  (outside the outline)
D4  7.62,41.91 0 top
D6  7.62,22.86 0 top
DAB+_AUDIO_I2S  67.31,6.35 180 top
DAB+_AUDIO_OUT  57.15,6.35 180 top
DAB_AM  19.05,41.91 90 top
FM  19.05,22.86 90 top
H1  110.49,3.81 0 top
H2  3.81,83.82 0 top
H3  3.81,3.81 0 top
H4  110.49,83.82 0 top
I2C_A  78.74,26.67 0 top
I2C_A_  78.74,22.86 0 top
I2C_OR_SPI  76.2,31.75 180 top
I2C_OR_SPI1  95.25,18.41 180 top
I2C_OR_SPI2  46.36,64.77 90 top
I2C_OR_SPI3  30.48,39.37 180 top
I2C_OR_SPI_  76.2,38.1 180 top
IC2  54.61,35.56 0 top
IC3  59.69,64.77 270 top
IC4  81.28,11.43 270 top
J1  67.31,78.74 0 top
L1  31.12,25.4 90 bottom
L2  37.59,29.21 90 bottom
L3  38.61,29.21 90 bottom
L4  74.93,52.07 270 bottom
L5  36.19,29.21 90 bottom
L6  30.48,29.85 180 bottom
L7  28.58,74.93 90 top
L8  40,29.21 90 bottom
L9  30.61,31.37 180 bottom
LED1  22.86,68.58 0 top
Q1  9.53,73.66 90 bottom
Q2  99.06,48.26 0 bottom
Q3  99.06,3.81 0 bottom
Q4  99.06,8.89 0 bottom
Q5  99.06,43.18 0 bottom
Q6  99.06,38.1 0 bottom
Q7  99.06,58.42 0 bottom
Q8  99.06,33.02 0 bottom
Q9  99.06,53.34 0 bottom
Q10  3.81,45.72 90 top
Q11  3.81,26.67 90 top
R1  66.68,66.04 90 top
R2  95.25,43.18 270 bottom
R3  95.25,8.89 270 bottom
R4  17.78,68.58 180 bottom
R5  2.54,73.66 270 bottom
R6  8.89,45.72 90 top
R7  31.12,83.82 270 top
R8  36.83,79.38 90 top
R9  67.31,10.16 270 bottom
R10  69.85,10.16 270 bottom
R11  31.12,74.93 270 top
R12  36.83,70.48 90 top
R13  51.44,64.77 0 top
R14  95.25,3.81 270 bottom
R15  64.77,10.16 270 bottom
R16  95.25,14.61 270 bottom
R17  95.25,48.26 270 bottom
R18  102.87,48.26 90 bottom
R19  36.83,38.1 270 bottom
R20  102.87,3.81 90 bottom
R21  102.87,8.89 90 bottom
R22  102.87,43.18 90 bottom
R23  95.25,38.1 270 bottom
R24  102.87,38.1 90 bottom
R25  95.25,58.42 270 bottom
R26  102.87,58.42 90 bottom
R27  95.25,33.02 270 bottom
R28  102.87,33.02 90 bottom
R29  71.12,29.21 90 top
R30  69.85,36.83 90 top
R31  95.25,53.34 270 bottom
R32  102.87,53.34 90 bottom
R33  20.32,34.29 270 bottom
R34  95.25,71.12 270 bottom
R35  95.25,64.77 90 bottom
R36  102.87,64.77 270 bottom
R37  85.09,58.42 270 bottom
R39  12.7,45.72 180 top
R40  8.89,26.67 90 top
R41  5.08,73.66 90 bottom
R44  12.7,26.67 180 top
RESET_PAD  78.74,58.42 90 top
RL1  7.62,34.29 0 top
RST  110.49,60.96 90 top
SV1  110.49,38.1 90 top
SV1_3V3  87,40.64 90 top
SV2  15.24,80.01 0 top
SV5  59.69,77.47 270 top
SV7  80.01,66.04 90 top
T1  99.06,64.77 0 bottom
T2  20.32,34.29 0 top
U1  38.1,83.82 0 top
U2  38.1,74.93 0 top
X1  5.08,13.97 180 top
X2  50.8,19.05 0 bottom
X3  5.08,52.07 180 top

### Tracks (layer width: path | path; a pad name or v marks a point on that pad's centre or on a via)
5V0_DAB_ENABLED  (via drill 0.5 pad 1.3)
  Top 0.33: U1.1 C35.1 R7.1 26.67,84.77 26.67,73.66 28.58,73.66 L7.1 27.94,73.98 v27.94,71.12
  Bottom 0.33: Q1.C 10.62,70.89 C30.+ 13.97,71.44 C31.1 | C31.1 C32.1 C33.1 21.59,71.52 C34.1 24.13,71.12 v27.94,71.12 | R4.1 16.83,71.44 C31.1
!DAB_ON!_OFF
  Bottom 0.33: SV2.4 19.05,83.82 8.89,83.82 8.89,82.55 6.35,80.01 6.35,78.74 5.08,77.47 3.81,77.47 2.54,76.2 R5.1
+1V8  (via drill 0.38 pad 1.3, 0.5 pad 1.3)
  Top 0.33: U2.5 C39.1 46.99,75.88 46.99,71.12 43.18,71.12 43.18,55.88 | v77.47,53.34 74.93,53.34 74.93,55.88 43.18,55.88 | 43.18,55.88 36.83,49.53 36.83,27.94 v30.48,21.59
  Bottom 0.33: L4.1 74.93,53.34 v77.47,53.34 | v30.48,21.59 30.48,23.82 L1.1
+3V3  (via drill 0.5 pad 1.3)
  Top 0.33: U1.5 C36.1 43.18,85.09 v46.99,85.09 | v82.55,17.78 72.39,17.78 57.15,33.02 57.15,34.29 v54.61,34.29
  Bottom 0.305: IC2.34 60.96,36.83 60,36.83 C28.1
  Bottom 0.33: C5.2 81.59,15.24 IC4.8 85.09,18.41 | I2C_A.3 I2C_A_.3 81.28,22.22 82.87,20.64 | 95.56,48.89 arc-90 R17.1 96.52,49.21 | 96.52,44.13 R2.1 | 96.52,39.05 R23.1 | 96.52,33.97 R27.1 | 96.52,44.13 96.52,45.72 100.01,45.72 Q2.1 100.01,48.26 96.52,48.26 96.52,49.21 | 96.52,39.05 96.52,40.64 100.01,40.64 Q5.1 100.01,43.18 96.52,43.18 96.52,44.13 | 96.52,33.97 96.52,35.56 100.01,35.56 Q6.1 100.01,38.1 96.52,38.1 96.52,39.05 | 100.01,21.59 100.01,13.33 96.52,9.84 | 100.01,21.59 Q8.1 100.01,33.02 96.52,33.02 96.52,33.97 | 96.52,9.84 R3.1 | 96.52,4.76 R14.1 | 96.52,4.76 96.52,6.35 100.01,6.35 Q4.1 100.01,8.89 96.52,8.89 96.52,9.84 | Q3.1 100.01,3.81 96.52,3.81 96.52,4.76 | 82.87,20.64 85.09,18.41 | 100.01,21.59 92.71,21.59 I2C_OR_SPI1.3 85.09,18.41 | 96.52,54.29 96.52,53.34 100.01,53.34 Q9.1 100.01,50.8 96.52,50.8 96.52,49.21 | 96.52,54.29 R31.1 | 96.52,54.29 96.52,55.88 100.01,55.88 Q7.1 100.01,58.42 96.52,58.42 96.52,59.37 R25.1 93.34,59.37 93.34,63.5 | R35.2 94.94,65.41 93.34,65.41 93.34,63.5 | 93.34,63.5 80.01,63.5 80.01,66.04 84.46,66.04 84.46,70.17 R34.2 96.2,70.17 97.79,68.58 104.14,68.58 104.14,77.47 80.01,77.47 80.01,78.74 J1.1 68.58,85.09 v46.99,85.09 46.99,67.31 I2C_OR_SPI2.3 27.94,67.31 I2C_OR_SPI3.3 | C28.1 C22.1 54.61,36.52 | C28.1 59.69,36.2 | 59.69,36.83 C28.1 | v82.55,17.78 82.55,20.32 82.87,20.64 | C19.1 54.61,36.52 | v54.61,34.29 54.61,36.52
+5V  (via drill 0.5 pad 1.3)
  Top 0.33: v101.6,45.72 v101.6,40.64 v101.6,35.56 v101.6,30.48 v101.6,6.35 v101.6,1.27
  Top 0.508: v101.6,45.72 v101.6,50.8 v101.6,56.2 101.6,86.36 11.43,86.36 SV2.1
  Bottom 0.33: R41.2 Q1.E 8.43,80.01 SV2.1 | v101.6,50.8 101.6,52.39 R32.1 | v101.6,45.72 101.6,47.31 R18.1 | R22.1 101.6,42.23 v101.6,40.64 | R24.1 101.6,37.15 v101.6,35.56 | R28.1 101.6,32.07 v101.6,30.48 | R21.1 101.6,7.94 v101.6,6.35 | R20.1 101.6,2.86 v101.6,1.27
  Bottom 0.406: R26.1 v101.6,56.2
AMLOOPN  (1 unrouted)
  Bottom 0.254: 35.56,34.29 26.67,34.29 T2.P$6
  Bottom 0.33: IC2.6 44.45,35.56 35.56,35.56 35.56,34.29
AMLOOPP  (1 unrouted)
  Bottom 0.254: T2.P$4 27.81,31.75 28.7,32.64 36.7,32.64 36.7,34.16 36.83,34.29
  Bottom 0.33: 36.83,34.29 IC2.7
DAB/AM_POSITION
  Top 0.61: DAB_AM.2 15.24,43.18 15.24,44.13 R39.1
DAB_ANTENA
  Bottom 1.27: X1.1 RL1.P$9
FLASH_CE  (via drill 0.5 pad 1.3)
  Top 0.33: v59.69,59.69 59.69,66.67 IC3.1
  Bottom 0.33: SV5.1 59.69,81.28 v59.69,59.69 59.69,57.15 44.45,57.15 44.45,44.45 43.18,43.18 IC2.1
FLASH_SCK  (via drill 0.5 pad 1.3)
  Top 0.33: v64.26,60.07 65.41,60.07 65.41,64.13 IC3.6
  Bottom 0.305: 63.5,76.2 63.5,60.83 v64.26,60.07
  Bottom 0.33: SV5.6 63.5,76.2 | v64.26,60.07 64.77,60.07 64.77,53.34 52.07,53.34 52.07,43.18 50.8,41.91 IC2.2
FLASH_SI  (via drill 0.5 pad 1.3)
  Top 0.33: v62.23,61.34 62.23,62.86 IC3.5
  Bottom 0.33: IC2.48 46.99,44.45 46.99,55.88 62.23,55.88 v62.23,61.34 62.23,73.66 SV5.8
FLASH_SO  (via drill 0.5 pad 1.3)
  Top 0.33: v63.5,58.42 58.42,58.42 58.42,65.41 IC3.2 53.97,65.41 53.97,77.47 v54.61,77.47
  Bottom 0.33: SV5.3 54.61,78.74 v54.61,77.47 | IC2.47 48.26,54.61 63.5,54.61 v63.5,58.42
FM/AM_ANTENA
  Bottom 1.27: X3.1 5.08,45.72 6.35,44.45 6.35,40.64 7.62,39.37 RL1.P$3
FM/AM_ANTENA_TO_SI468X_FM/DAB_ANTENA_INPUT
  Bottom 0.33: RL1.P$4 RL1.P$7
FM_POSITION
  Top 0.61: FM.2 15.24,24.13 15.24,25.08 R44.1
GND  (via drill 0.5, 0.5 pad 1.3)  (2 unrouted)
  Top 0.33: R8.1 C37.2 41.28,78.42 41.28,82.55 | 41.28,82.55 41.28,83.82 U1.2 34.93,83.82 34.93,82.87 C35.2 | C36.2 43.18,82.55 41.28,82.55 | 41.28,73.98 41.28,74.93 U2.2 34.93,74.93 34.93,73.98 C38.2 | 41.28,73.98 C39.2 | 41.28,73.98 41.28,69.22 39.37,69.22 C40.2 R12.1 33.02,69.53 v33.02,68.58 | IC3.4 53.34,62.86 v53.34,62.23 | C10.2 v58.42,69.85
  Bottom 0.254: L5.1 36.52,27.94 37.59,27.94 L2.1 | D1.A 28.76,26.22 29.21,26.67 29.21,27.94 33.24,27.94 C3.1
  Bottom 0.33: X2.4 X2.2 49.65,16.31 arc-90 C12.2 50.8,16.19 | 50.8,16.19 C14.2 | C13.2 62.23,3.81 | 62.23,3.81 54.61,3.81 DAB+_AUDIO_OUT.3 C23.2 54.29,8.89 50.8,8.89 50.8,10.16 | 50.8,12.7 50.8,16.19 | 50.8,12.7 55.25,12.7 C20.2 | IC4.3 IC4.2 IC4.1 76.2,16.51 I2C_A_.1 I2C_A.1 | IC4.3 IC4.4 77.47,5.08 C5.1 arc-90 80.01,4.77 80.01,3.18 83.82,3.18 83.82,6.35 82.55,7.62 82.55,11.43 96.52,11.43 97.79,12.7 I2C_OR_SPI1.1 | IC2.41 57.15,46.99 | 57.15,46.99 IC2.EP IC2.40 IC2.42 | I2C_OR_SPI2.1 v53.34,62.23 53.34,69.85 | SV5.7 53.34,73.66 53.34,69.85 | v58.42,69.85 53.34,69.85 | L5.1 C3.1 | T2.P$3 18.73,31.75 R33.2 24.13,33.34 T2.P$5 | T1.E 97.79,63.67 97.79,63.5 | SV2.2 C30.- 13.97,73.34 C31.2 C32.2 C33.2 21.59,73.27 C34.2 30.48,73.27 30.48,68.58 | LED1.K 30.48,68.58 | C1.2 57.15,50.17 57.15,46.99 | 50.8,10.16 50.8,12.7 | IC4.3 73.66,10.16 73.66,2.54 62.23,2.54 62.23,3.81 | D1.A 25.4,22.86 27.94,20.32 34.29,20.32 C24.2 C25.2 40.64,20.64 40.64,15.24 45.72,10.16 50.8,10.16 | v33.02,68.58 30.48,68.58
  other vias: 39.37,55.88 30.48,55.88 49.53,82.55 49.53,72.39 71.12,72.39 71.12,62.23 71.12,82.55 95.25,82.55 95.25,74.93 109.22,74.93 21.59,64.77 12.7,55.88 3.81,64.77 3.81,78.74 39.37,46.99 31.75,35.56 45.72,17.78 62.23,17.78 97.79,27.94 85.09,24.13 80.01,53.34 39.37,7.62 30.48,17.78 21.59,7.62 12.7,17.78 106.55,61.21 97.66,61.21 106.55,54.86 1.91,19.68 104.14,17.78 110.49,17.78 104.14,29.85 106.68,42.55 71.12,53.34
  pour Bottom (isolate 0.61): -2.54,-2.54 -2.54,88.9 116.84,88.9 116.84,-2.54
  pour Top (isolate 0.61): -3.81,-3.81 -3.81,90.17 118.11,90.17 118.11,-3.81
ID_SC
  Bottom 0.33: Q4.3 102.72,9.99 R21.2 102.87,25.4 107.95,30.48 SV1.2
ID_SD
  Bottom 0.33: Q3.3 99.21,4.76 R20.2 103.82,4.76 106.68,7.62 106.68,26.67 107.95,27.94 SV1.1
INT
  Bottom 0.33: Q9.3 102.72,54.44 arc-90 R32.2 104.46,54.29 104.78,53.97 104.78,49.53 108.59,45.72 SV1.8
N$1
  Bottom 0.254: L9.1 30.06,31.33 29.21,30.48 29.21,30.17 L6.1 | D1.K 27.12,27.12 27.94,27.94 27.94,29.85
  Bottom 0.406: C6.2 27.94,29.85 L6.1
N$2
  Bottom 0.254: L3.2 38.61,30.16 38.1,30.16 37.99,30.16 arc90 L2.2 | L9.2 31.16,30.12 L6.2
  Bottom 0.33: IC2.10 44.45,30.48 41.91,30.48 41.59,30.16 L8.2 38.1,30.16 L5.2 C3.2 31.75,30.16 L6.2
N$3
  Bottom 0.254: L8.1 38.61,28.26 L3.1
  Bottom 0.33: IC2.11 42.23,28.26 L8.1
N$4
  Bottom 0.33: IC2.13 46.04,24.13 C16.2 C21.2 C15.2
N$5
  Bottom 0.33: C9.2 C17.2 C18.2 69.85,44.13 69.85,47.31 | C19.2 C22.2 C28.2 59.69,39.37 IC2.36 64.77,43.18 C2.2 C4.2 69.85,47.31 | 69.85,47.31 C7.2
N$6
  Bottom 0.33: IC2.15 53.97,20.96 53.97,18.15 | C14.1 53.97,14.29 53.97,18.15 | X2.1 53.97,18.15
N$7
  Bottom 0.33: X2.3 49.53,20.07 48.51,20.07 arc-90 48.26,20.32 | 49.21,14.29 C12.1 48.26,14.29 48.26,20.32 | 48.26,20.32 48.26,21.59 49.53,22.86 49.53,25.4 IC2.16
N$8
  Bottom 0.33: IC2.17 53.34,22.86 55.25,20.96 C20.1
N$9  (via drill 0.5 pad 1.3)
  Top 0.33: RESET_PAD.1 v78.74,59.69
  Bottom 0.33: SV7.8 SV7.6 SV7.4 SV7.2 v78.74,59.69 78.74,55.88 68.58,55.88 68.58,52.07 54.61,52.07 54.61,43.81 51.44,40.64 46.99,40.64 IC2.4
N$10  (via drill 0.5 pad 1.3)
  Top 0.33: R13.1 v48.9,64.77
  Bottom 0.33: v48.9,64.77 I2C_OR_SPI2.2
N$11
  Top 0.33: U2.1 C38.1 R11.1 L7.2
N$12
  Bottom 0.33: IC2.12 C16.1 C21.1 C15.1 C25.1 C24.1 L1.2
N$13  (via drill 0.5 pad 1.3)
  Top 0.61: DAB_AM.1 v14.61,40.64
  Bottom 0.61: D4.A 12.7,40.64 | 12.7,40.64 RL1.P$5 | v14.61,40.64 12.7,40.64
N$14
  Bottom 0.33: IC2.37 60.96,50.17 | IC2.35 66.04,42.23 C18.1 C17.1 C9.1 78.74,42.23 78.74,46.03 73.03,46.03 73.03,49.21 | 73.03,49.21 C7.1 C4.1 C2.1 63.81,50.17 60.96,50.17 | C1.1 60.96,50.17 | L4.2 73.03,51.12 73.03,49.21
N$15
  Bottom 0.33: R9.1 67.31,20.32 64.77,22.86 64.77,30.48 IC2.28
N$16  (via drill 0.5 pad 1.3)
  Top 0.33: v68.58,39.37 67.94,38.73 v67.94,26.67
  Bottom 0.33: IC2.33 v68.58,39.37 | v67.94,26.67 69.85,24.77 R10.1
N$17
  Bottom 0.33: IC4.7 94.3,12.7 R16.2
N$18
  Bottom 0.33: R4.2 LED1.A
N$19
  Bottom 0.33: R5.2 R41.1 Q1.B
N$20
  Top 0.33: U1.4 39.37,82.87 C37.1
N$21
  Top 0.33: U1.3 36.83,82.87 R8.2 31.12,80.33 R7.2
N$22  (via drill 0.5 pad 1.3)
  Top 0.33: 66.68,65.41 R1.1 64.77,65.09 v64.77,65.41 IC3.7
  Bottom 0.33: SV5.4 64.77,78.74 v64.77,65.41
N$23
  Bottom 0.33: IC2.27 64.77,33.02 62.23,33.02 60.96,31.75 60.96,29.21 63.5,26.67 63.5,21.59 64.77,20.32 R15.1
N$24
  Top 0.33: C40.1 39.37,73.98 U2.4
N$25
  Top 0.33: U2.3 36.83,73.98 R12.2 31.12,71.44 R11.2
N$26
  Bottom 0.33: I2C_OR_SPI3.2 30.48,42.22 36.83,42.22 R19.1
N$27
  Bottom 0.33: IC2.5 36.83,36.83 R19.2
N$28
  Bottom 0.33: R16.1 I2C_OR_SPI1.2
N$29  (via drill 0.5 pad 1.3)
  Top 0.33: v88.9,29.21 v88.9,7.62
  Bottom 0.33: Q3.2 95.3,2.81 R14.2 88.9,2.86 v88.9,7.62 IC4.5 | SV1_3V3.1 88.9,29.85 v88.9,29.21
N$30  (via drill 0.5 pad 1.3)
  Top 0.33: v90.17,34.29 v90.17,10.16
  Bottom 0.33: Q4.2 98.06,7.94 R3.2 90.17,7.94 v90.17,10.16 IC4.6 | SV1_3V3.2 v90.17,34.29
N$31
  Bottom 0.33: IC2.32 64.77,38.1 69.85,38.1 69.85,40.64 76.2,40.64 I2C_OR_SPI_.2
N$32
  Bottom 0.33: IC2.31 68.58,36.83 69.85,35.56 81.28,35.56 81.28,44.45 SV1_3V3.6 92.71,44.45 92.71,42.23 R2.2 95.25,42.18 Q5.2
N$33
  Bottom 0.33: IC2.30 64.77,35.56 67.31,35.56 68.58,34.29 82.55,34.29 82.55,41.91 SV1_3V3.5 91.44,41.91 91.44,37.15 R23.2 95.25,37.1 Q6.2
N$34
  Bottom 0.33: Q8.2 95.25,32.02 R27.2 93.66,32.07 92.71,33.02 92.71,33.34 90.17,35.88 90.17,39.37 SV1_3V3.4 83.82,39.37 83.82,31.75 I2C_OR_SPI.1 78.74,32.07
N$35  (via drill 0.5 pad 1.3)
  Top 0.33: R29.1 72.71,28.26 73.66,29.21 v78.74,29.21
  Bottom 0.33: v78.74,29.21 I2C_A.2
N$36  (via drill 0.5 pad 1.3)
  Top 0.33: R30.1 69.85,31.75 69.22,31.11 69.22,27.31 69.85,26.67 71.12,26.67 74.3,23.5 74.3,20.32 v78.74,20.32
  Bottom 0.33: v78.74,20.32 I2C_A_.2
N$37  (via drill 0.5 pad 1.3)
  Top 0.33: v71.12,31.75 R29.2
  Bottom 0.33: I2C_OR_SPI.3 v71.12,31.75
N$38  (via drill 0.5 pad 1.3)
  Top 0.33: v71.75,38.1 70.17,38.1 R30.2
  Bottom 0.33: I2C_OR_SPI_.3 v71.75,38.1
N$39  (via drill 0.38 pad 1.3, 0.5 pad 1.3)
  Top 0.305: v48.26,38.1 52.07,41.91
  Top 0.33: 52.07,41.91 60.96,41.91 64.77,45.72 81.28,45.72 83.82,48.26 v83.82,49.53
  Bottom 0.305: 44.45,38.1 v48.26,38.1
  Bottom 0.33: R31.2 98.06,52.39 arc-90 Q9.2 | R31.2 95.25,52.07 | 44.45,38.1 IC2.3 | R31.2 91.44,52.39 91.44,49.53 SV1_3V3.8 v83.82,49.53
N$41
  Bottom 0.33: R35.1 95.4,63.67 96.89,63.67 96.89,65.87 | SV7.3 85.72,64.77 85.72,67.94 95.62,67.94 96.89,66.67 96.89,65.87 | T1.C 96.89,65.87
N$44  (via drill 0.5 pad 1.3)
  Top 0.33: R1.2 66.68,66.67 IC3.8 63.29,69.85 | C10.1 63.29,69.85 | v66.04,69.85 63.29,69.85
  Bottom 0.33: SV5.2 66.04,81.28 J1.2 v66.04,69.85
N$45  (via drill 0.5 pad 1.3)
  Top 0.33: IC3.3 52.71,64.13 52.71,64.77 R13.2 52.39,66.67 v52.07,66.67
  Bottom 0.33: SV5.5 52.07,76.2 v52.07,66.67
N$46
  Bottom 0.33: DAB+_AUDIO_OUT.1 C27.2
N$47
  Bottom 0.33: DAB+_AUDIO_OUT.2 C29.2
N$48
  Bottom 0.33: IC2.29 68.58,31.75 68.58,29.21 76.2,29.21 I2C_OR_SPI.2
N$50
  Bottom 0.33: Q2.2 95.25,47.26 R17.2 93.98,47.31 93.98,46.99 SV1_3V3.7 79.69,46.99 79.69,38.1 I2C_OR_SPI_.1
N$51
  Bottom 0.33: R36.2 103.19,63.5 RST.3
N$52
  Bottom 0.33: SV7.5 83.19,67.31 83.19,72.07 R34.1 98.11,72.07 C8.2
N$54
  Bottom 0.33: R36.1 102.06,65.72 T1.B
N$55
  Bottom 0.33: Q7.2 98.11,57.47 R25.2 R37.2
N$56
  Bottom 0.33: Q7.3 102.87,59.52 R26.2 107,59.37 107.95,58.42 RST.1
N$57
  Bottom 0.33: SV7.1 85.09,62.23 R37.1
N$58
  Top 0.61: R39.2 10.8,44.77 R6.1 Q10.B
N$59
  Top 0.61: Q10.E R6.2 8.89,47.62 15.88,47.62 15.88,45.72 DAB_AM.3
N$60  (via drill 0.5 pad 1.3)
  Top 0.61: Q10.C 2.54,45.55 v2.54,43.81
  Bottom 0.61: v2.54,43.81 D4.C RL1.P$1
N$63
  Top 0.61: Q11.B R40.1 10.8,25.72 R44.2
N$64
  Top 0.61: Q11.E R40.2 8.89,28.57 15.24,28.57 17.15,26.67 FM.3
N$66  (via drill 0.5 pad 1.3)
  Top 0.61: FM.1 v14.61,21.59
  Bottom 0.61: RL1.P$6 D6.A 12.7,21.59 v14.61,21.59
N$68  (via drill 0.5 pad 1.3)
  Top 0.61: Q11.C 2.54,26.84 v2.54,28.57
  Bottom 0.61: RL1.P$10 v2.54,28.57 D6.C
PCM_CLK
  Bottom 0.33: R15.2 DAB+_AUDIO_I2S.3
PCM_DIN
  Bottom 0.33: R10.2 DAB+_AUDIO_I2S.1
PCM_FS
  Bottom 0.33: R9.2 DAB+_AUDIO_I2S.2
SI468X_FM/DAB_ANTENA_INPUT
  Bottom 0.33: C6.1 25.72,28.57 14.61,28.57 14.61,32.39 11.43,32.39 11.43,28.57 7.62,28.57 RL1.P$8
SI4685_AM_ANTENA_INPUT
  Bottom 0.254: 20.69,34.87 R33.1
  Bottom 0.33: R33.1 18.73,36.83 T2.P$1 14.61,36.83 14.61,36.2 11.43,36.2 11.43,40 8.89,40 8.89,35.56 5.08,35.56 RL1.P$2
SI4688_LOUT
  Bottom 0.33: C23.1 C29.1 57.15,20.32 54.61,22.86 54.61,25.4 IC2.18
SI4688_ROUT
  Bottom 0.33: C13.1 C27.1 59.69,19.05 55.88,22.86 IC2.19
SI4688_RSTB
  Bottom 0.33: SV1.9 110.49,52.07 113.03,54.61 113.03,60.96 RST.2
SPI0_CE0_N
  Bottom 0.33: Q8.3 102.87,34.12 R28.2 102.87,34.29 104.14,35.56 SV1.4
SPI0_MISO
  Bottom 0.33: Q2.3 102.87,49.36 R18.2 103.83,49.21 104.14,48.89 104.14,47.62 108.59,43.18 SV1.7
SPI0_MOSI
  Bottom 0.33: Q5.3 99.21,44.13 R22.2 104.46,44.13 104.46,41.59 105.41,40.64 SV1.6
SPI0_SCLK
  Bottom 0.33: Q6.3 102.87,39.2 R24.2 104.46,39.05 105.41,38.1 SV1.5

### Text on the board
Top: si468x DAB+
Bottom: si468x DAB+
Document: FM/AM | DAB+